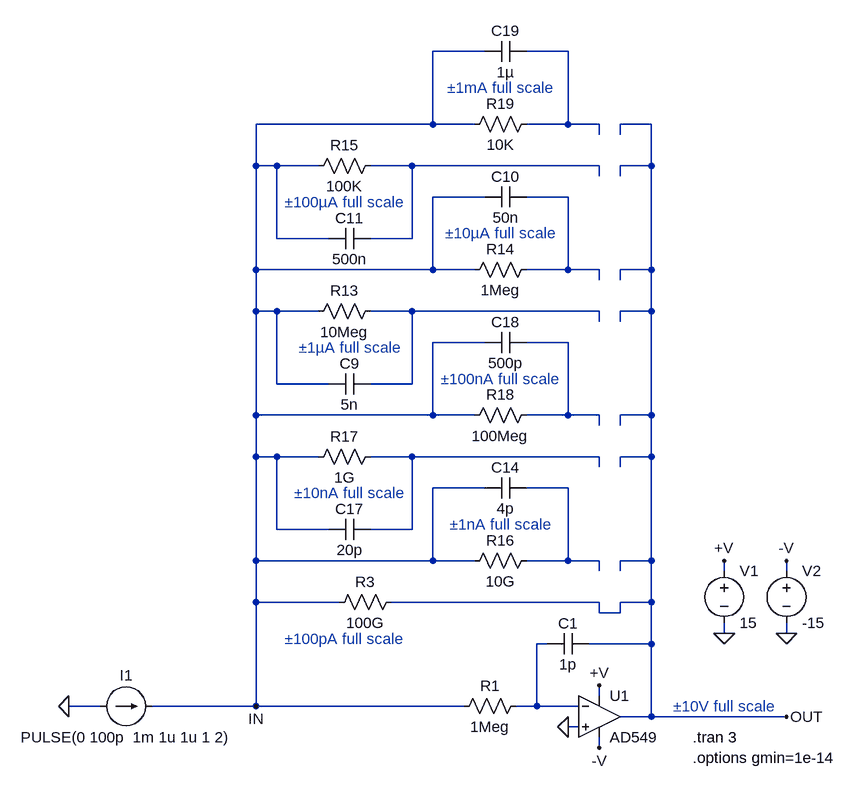
[diagram p0: schematic ElectrometerAD549.asc]
ElectrometerAD549.asc, the LTspice schematic file:
Version 4
SHEET 1 2884 3000
WIRE 32 -976 -48 -976
WIRE 160 -976 96 -976
WIRE -48 -864 -48 -976
WIRE -48 -864 -320 -864
WIRE 16 -864 -48 -864
WIRE 160 -864 160 -976
WIRE 160 -864 96 -864
WIRE 208 -864 160 -864
WIRE 288 -864 240 -864
WIRE 208 -848 208 -864
WIRE 240 -848 240 -864
WIRE -320 -800 -320 -864
WIRE -288 -800 -320 -800
WIRE -224 -800 -288 -800
WIRE -80 -800 -144 -800
WIRE 208 -800 -80 -800
WIRE 288 -800 288 -864
WIRE 288 -800 240 -800
WIRE 208 -784 208 -800
WIRE 240 -784 240 -800
WIRE 32 -752 -48 -752
WIRE 160 -752 96 -752
WIRE -288 -688 -288 -800
WIRE -208 -688 -288 -688
WIRE -80 -688 -80 -800
WIRE -80 -688 -144 -688
WIRE -320 -640 -320 -800
WIRE -48 -640 -48 -752
WIRE -48 -640 -320 -640
WIRE 16 -640 -48 -640
WIRE 160 -640 160 -752
WIRE 160 -640 96 -640
WIRE 208 -640 160 -640
WIRE 288 -640 288 -800
WIRE 288 -640 240 -640
WIRE 208 -624 208 -640
WIRE 240 -624 240 -640
WIRE -320 -576 -320 -640
WIRE -288 -576 -320 -576
WIRE -224 -576 -288 -576
WIRE -80 -576 -144 -576
WIRE 208 -576 -80 -576
WIRE 288 -576 288 -640
WIRE 288 -576 240 -576
WIRE 208 -560 208 -576
WIRE 240 -560 240 -576
WIRE 32 -528 -48 -528
WIRE 160 -528 96 -528
WIRE -288 -464 -288 -576
WIRE -208 -464 -288 -464
WIRE -80 -464 -80 -576
WIRE -80 -464 -144 -464
WIRE -320 -416 -320 -576
WIRE -48 -416 -48 -528
WIRE -48 -416 -320 -416
WIRE 16 -416 -48 -416
WIRE 160 -416 160 -528
WIRE 160 -416 96 -416
WIRE 208 -416 160 -416
WIRE 288 -416 288 -576
WIRE 288 -416 240 -416
WIRE 208 -400 208 -416
WIRE 240 -400 240 -416
WIRE -320 -352 -320 -416
WIRE -288 -352 -320 -352
WIRE -224 -352 -288 -352
WIRE -80 -352 -144 -352
WIRE 208 -352 -80 -352
WIRE 288 -352 288 -416
WIRE 288 -352 240 -352
WIRE 208 -336 208 -352
WIRE 240 -336 240 -352
WIRE 32 -304 -48 -304
WIRE 160 -304 96 -304
WIRE -288 -240 -288 -352
WIRE -208 -240 -288 -240
WIRE -80 -240 -80 -352
WIRE -80 -240 -144 -240
WIRE -320 -192 -320 -352
WIRE -48 -192 -48 -304
WIRE -48 -192 -320 -192
WIRE 16 -192 -48 -192
WIRE 160 -192 160 -304
WIRE 160 -192 96 -192
WIRE 208 -192 160 -192
WIRE 288 -192 288 -352
WIRE 288 -192 240 -192
WIRE 208 -176 208 -192
WIRE 240 -176 240 -192
WIRE 400 -176 400 -192
WIRE 496 -176 496 -192
WIRE -320 -128 -320 -192
WIRE -192 -128 -320 -128
WIRE 208 -128 -112 -128
WIRE 288 -128 288 -192
WIRE 288 -128 240 -128
WIRE 208 -112 208 -128
WIRE 240 -112 240 -128
WIRE 240 -112 208 -112
WIRE 400 -80 400 -96
WIRE 496 -80 496 -96
WIRE 128 -64 112 -64
WIRE 288 -64 288 -128
WIRE 288 -64 192 -64
WIRE 208 16 208 0
WIRE -560 32 -608 32
WIRE -320 32 -320 -128
WIRE -320 32 -480 32
WIRE 0 32 -320 32
WIRE 112 32 112 -64
WIRE 112 32 80 32
WIRE 176 32 112 32
WIRE 288 48 288 -64
WIRE 288 48 240 48
WIRE 496 48 288 48
WIRE 176 64 160 64
WIRE 208 96 208 80
FLAG 400 -80 0
FLAG 496 -80 0
FLAG 400 -192 +V
FLAG 496 -192 -V
FLAG 208 0 +V
FLAG 208 96 -V
FLAG 160 64 0
FLAG -608 32 0
FLAG 496 48 OUT
FLAG -320 32 IN
SYMBOL voltage 400 -192 R0
SYMATTR InstName V1
SYMATTR Value 15
SYMBOL voltage 496 -192 R0
SYMATTR InstName V2
SYMATTR Value -15
SYMBOL current -560 32 M90
WINDOW 0 -32 40 VBottom 2
WINDOW 3 32 40 VTop 2
WINDOW 123 74 40 VTop 2
WINDOW 39 53 40 VTop 2
SYMATTR InstName I1
SYMATTR Value PULSE(0 100p  1m 1u 1u 1 2)
SYMBOL res -96 -144 R90
WINDOW 0 0 56 VBottom 2
WINDOW 3 32 56 VTop 2
SYMATTR InstName R3
SYMATTR Value 100G
SYMBOL cap 192 -48 M270
WINDOW 0 32 32 VTop 2
WINDOW 3 0 32 VBottom 2
SYMATTR InstName C1
SYMATTR Value 1p
SYMBOL res -128 -592 R90
WINDOW 0 0 56 VBottom 2
WINDOW 3 32 56 VTop 2
SYMATTR InstName R13
SYMATTR Value 10Meg
SYMBOL cap -144 -448 M270
WINDOW 0 32 32 VTop 2
WINDOW 3 0 32 VBottom 2
SYMATTR InstName C9
SYMATTR Value 5n
SYMBOL res 112 -656 R90
WINDOW 0 0 56 VBottom 2
WINDOW 3 32 56 VTop 2
SYMATTR InstName R14
SYMATTR Value 1Meg
SYMBOL res -128 -816 R90
WINDOW 0 0 56 VBottom 2
WINDOW 3 32 56 VTop 2
SYMATTR InstName R15
SYMATTR Value 100K
SYMBOL cap 96 -736 M270
WINDOW 0 32 32 VTop 2
WINDOW 3 0 32 VBottom 2
SYMATTR InstName C10
SYMATTR Value 50n
SYMBOL cap -144 -672 M270
WINDOW 0 32 32 VTop 2
WINDOW 3 0 32 VBottom 2
SYMATTR InstName C11
SYMATTR Value 500n
SYMBOL res 112 -208 R90
WINDOW 0 0 56 VBottom 2
WINDOW 3 32 56 VTop 2
SYMATTR InstName R16
SYMATTR Value 10G
SYMBOL cap 96 -288 M270
WINDOW 0 32 32 VTop 2
WINDOW 3 0 32 VBottom 2
SYMATTR InstName C14
SYMATTR Value 4p
SYMBOL res -128 -368 R90
WINDOW 0 0 56 VBottom 2
WINDOW 3 32 56 VTop 2
SYMATTR InstName R17
SYMATTR Value 1G
SYMBOL cap -144 -224 M270
WINDOW 0 32 32 VTop 2
WINDOW 3 0 32 VBottom 2
SYMATTR InstName C17
SYMATTR Value 20p
SYMBOL res 112 -432 R90
WINDOW 0 0 56 VBottom 2
WINDOW 3 32 56 VTop 2
SYMATTR InstName R18
SYMATTR Value 100Meg
SYMBOL cap 96 -512 M270
WINDOW 0 32 32 VTop 2
WINDOW 3 0 32 VBottom 2
SYMATTR InstName C18
SYMATTR Value 500p
SYMBOL res 112 -880 R90
WINDOW 0 0 56 VBottom 2
WINDOW 3 32 56 VTop 2
SYMATTR InstName R19
SYMATTR Value 10K
SYMBOL cap 96 -960 M270
WINDOW 0 32 32 VTop 2
WINDOW 3 0 32 VBottom 2
SYMATTR InstName C19
SYMATTR Value 1µ
SYMBOL Opamps\\AD549 208 -16 R0
SYMATTR InstName U1
SYMBOL res 96 16 R90
WINDOW 0 0 56 VBottom 2
WINDOW 3 32 56 VTop 2
SYMATTR InstName R1
SYMATTR Value 1Meg
TEXT 352 80 Left 2 !.tran 3\n.options gmin=1e-14
TEXT 56 -248 Center 2 ;±1nA full scale
TEXT -176 -520 Center 2 ;±1µA full scale
TEXT -184 -744 Center 2 ;±100µA full scale
TEXT 56 -696 Center 2 ;±10µA full scale
TEXT -184 -72 Center 2 ;±100pA full scale
TEXT -176 -296 Center 2 ;±10nA full scale
TEXT 56 -472 Center 2 ;±100nA full scale
TEXT 56 -920 Center 2 ;±1mA full scale
TEXT 400 48 Bottom 2 ;±10V full scale

The netlist it stands for:
* ElectrometerAD549.asc
V1 +V 0 15
V2 -V 0 -15
I1 0 IN PULSE(0 100p  1m 1u 1u 1 2)
R3 OUT IN 100G
C1 OUT N008 1p
R13 N004 IN 10Meg
C9 N004 IN 5n
R14 N003 IN 1Meg
R15 N002 IN 100K
C10 N003 IN 50n
C11 N002 IN 500n
R16 N007 IN 10G
C14 N007 IN 4p
R17 N006 IN 1G
C17 N006 IN 20p
R18 N005 IN 100Meg
C18 N005 IN 500p
R19 N001 IN 10K
C19 N001 IN 1µ
XU1 0 N008 +V -V OUT AD549  ; pins In+ In- V+ V- OUT
R1 N008 IN 1Meg
.tran 3
.options gmin=1e-14
* ±1nA full scale
* ±1µA full scale
* ±100µA full scale
* ±10µA full scale
* ±100pA full scale
* ±10nA full scale
* ±100nA full scale
* ±1mA full scale
* ±10V full scale
.backanno
.end